# EAGLE board REM_Scan (EAGLE 9.6.2)
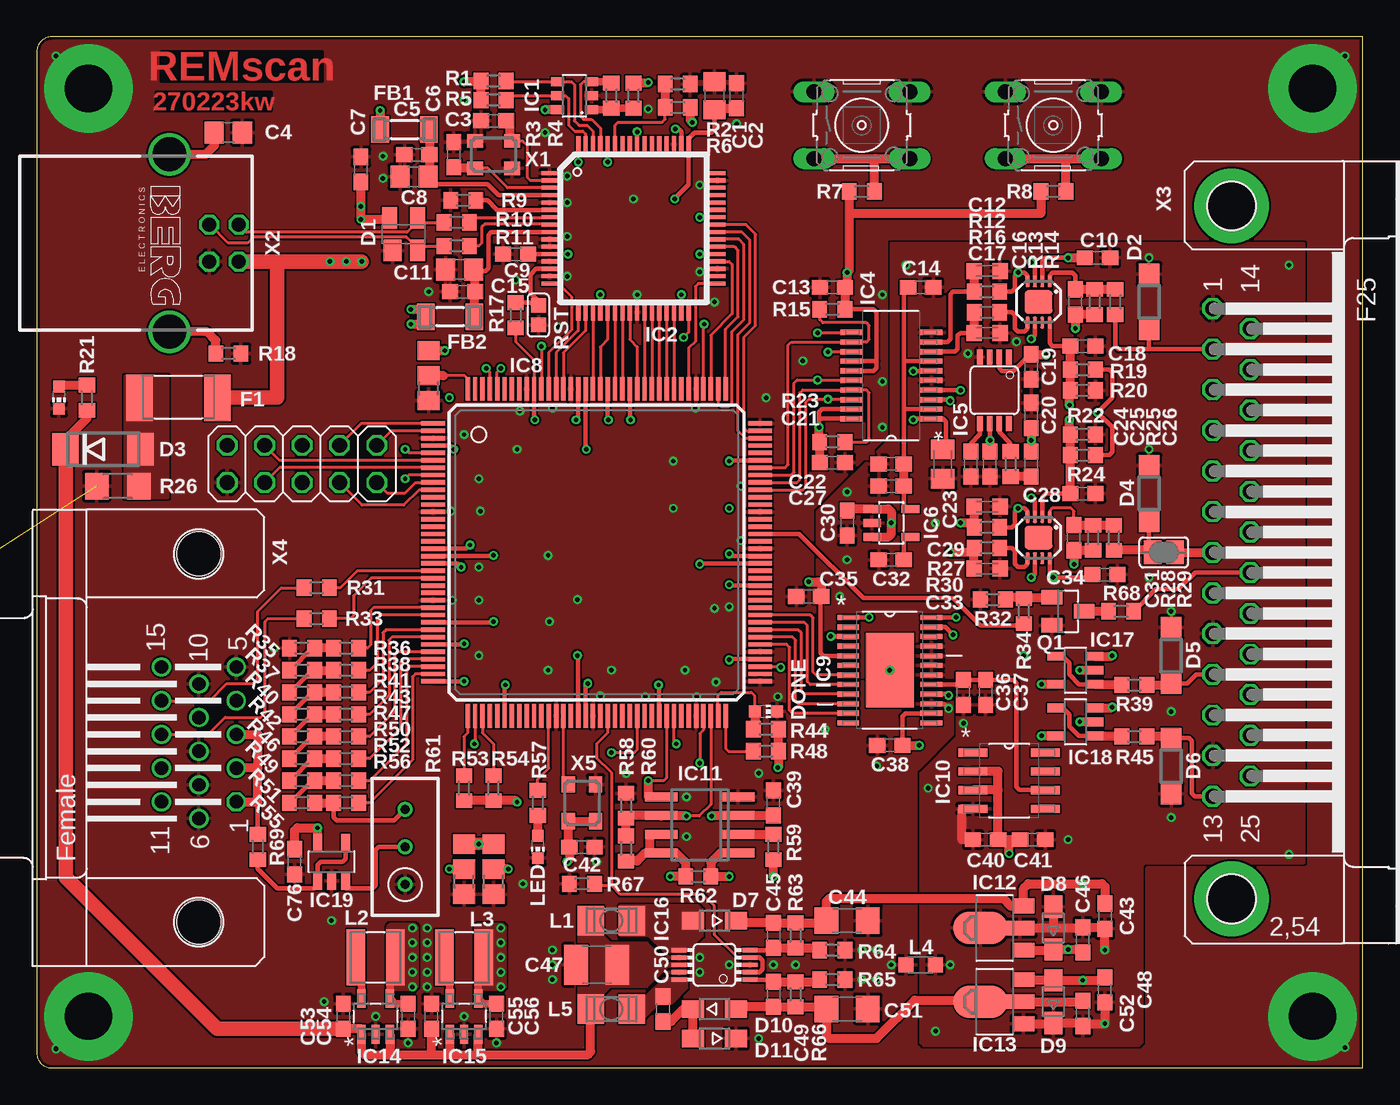
[diagram p5: board, top side]
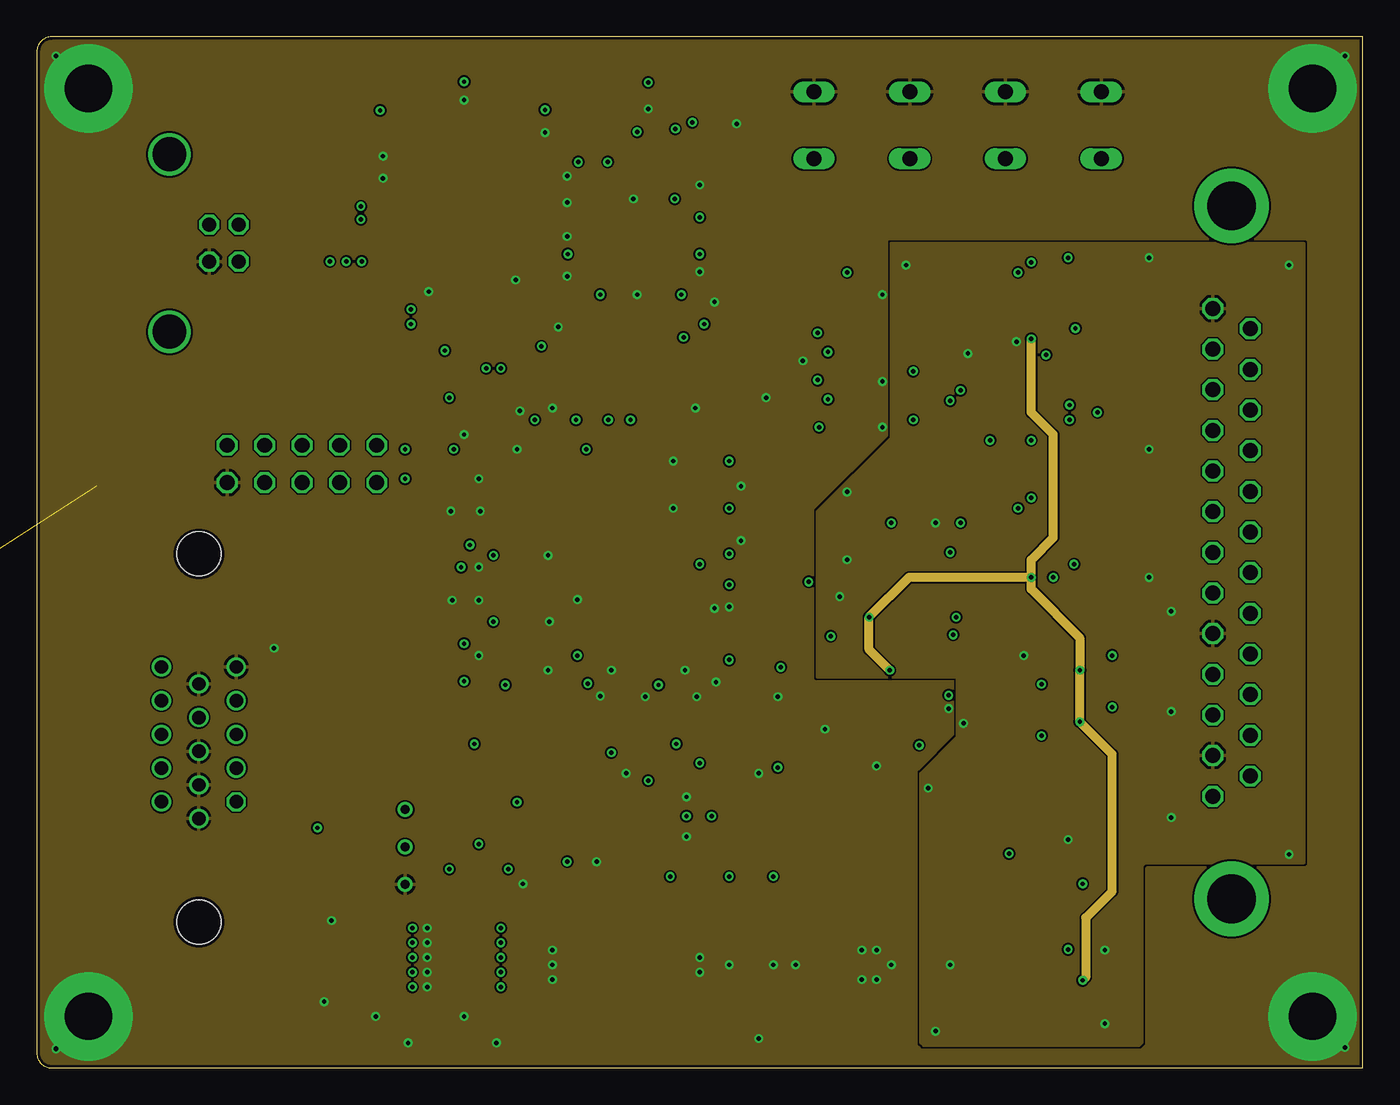
[diagram p6: board, inner layer Route2]
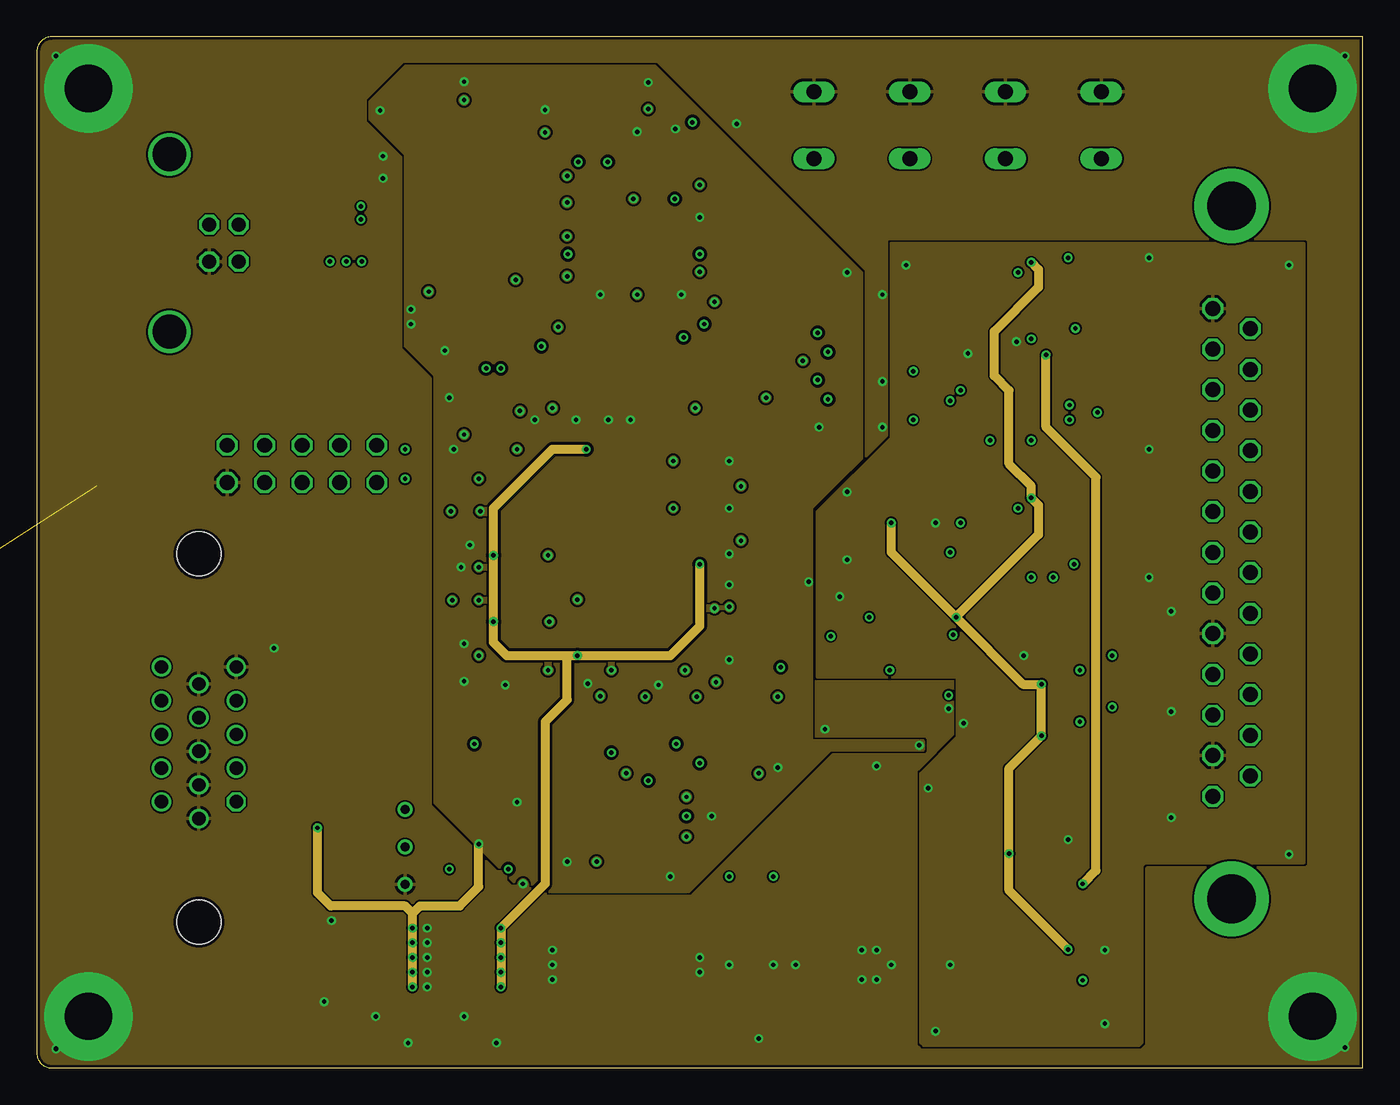
[diagram p7: board, inner layer Route15]
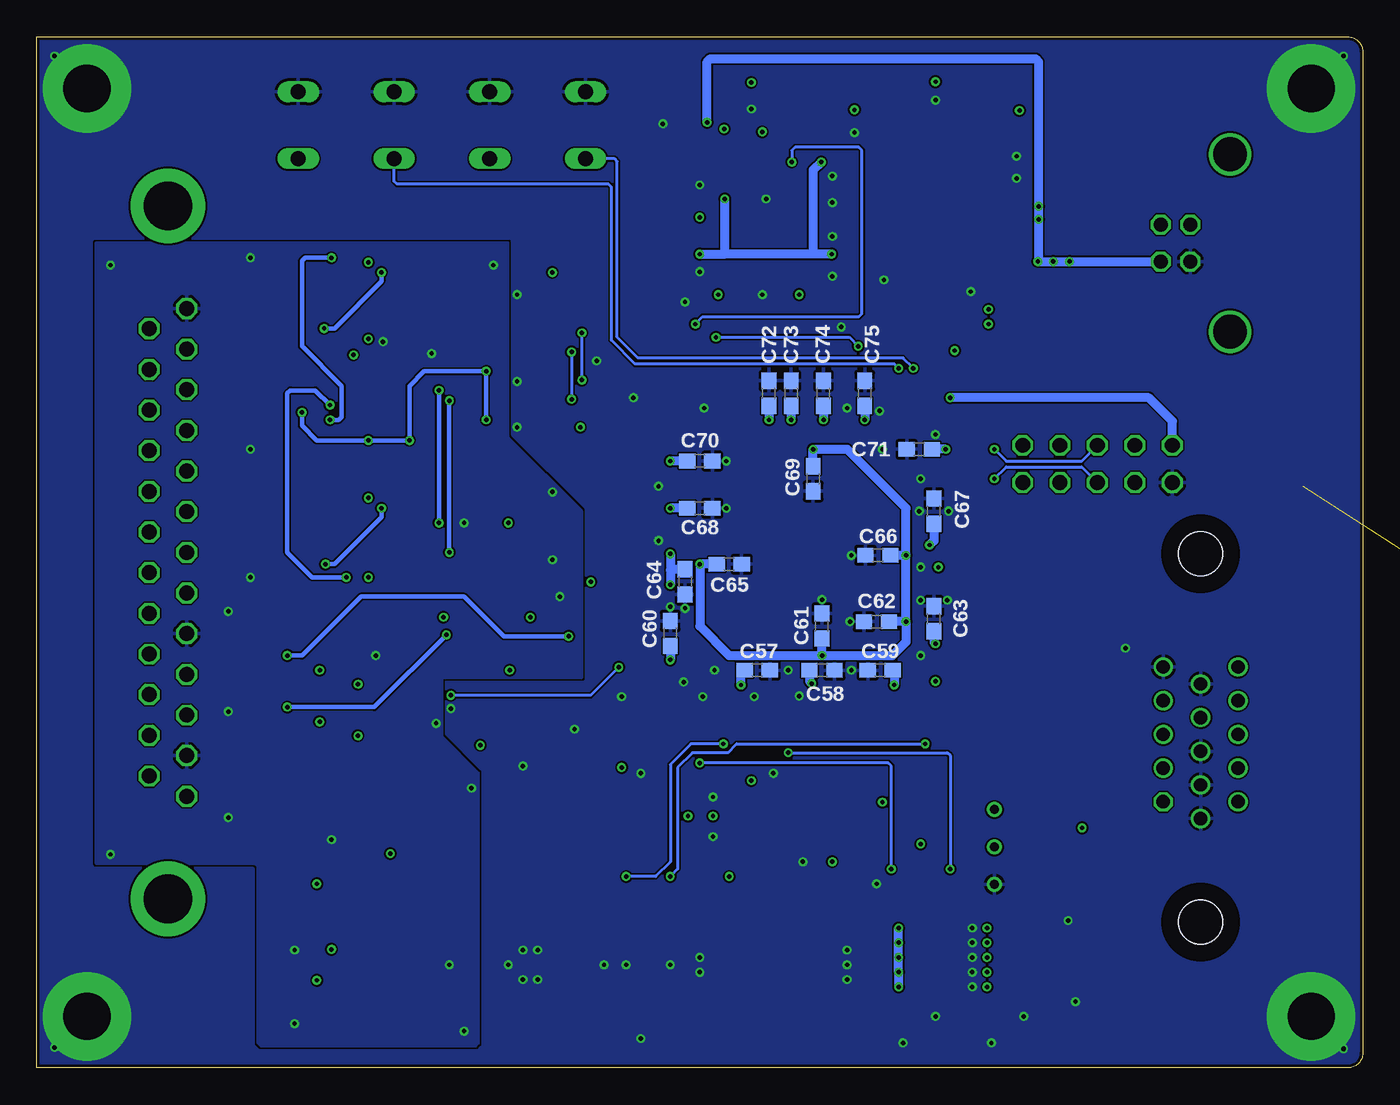
[diagram p8: board, bottom side, seen from below]

Size 90 x 70 mm. Coordinates in mm from the lower left corner, seen from the top.
Outline: 90,0 90,70 1,70 arc90 0,69 0,1 arc90 1,0 90,0
Copper layers (1+2*15+16): Top 0.035mm / dielectric 0.673mm / Route2 0.017mm / dielectric 0.15mm / Route15 0.017mm / dielectric 0.673mm / Bottom 0.035mm
Design rules "JLCPCB_4Layer_1oz": minimum track width 3.5mil, minimum drill 0.2mm, track to track 5mil, track to pad 0.2mm, pad to pad 5mil, via to via 5mil, smd to smd 0mil, copper to edge 0.2mm, drill to drill 0.5mm, minimum pad ring 0.2mm, minimum via ring 0.15mm, stop-mask expansion 0.075mm, vias tented up to drill 0.3mm, thermal gap 0.2mm

## Footprints (pad centres in the part's own frame; a part is rotated, then mirrored left to right if it is on the bottom)
BUTTON_3MM = drill 1.016 long: 1 -3.251,2.261; 2 3.251,2.261; 3 -3.251,-2.261; 4 3.251,-2.261
C0805 = smd 1.3 x 1.5: 1 -0.95,0; 2 0.95,0
C0603 = smd 1.1 x 1: 1 -0.85,0; 2 0.85,0
C0603K = smd 1.05 x 1.08: 1 -0.875,0; 2 0.875,0
C0805K = smd 1.3 x 1.6: 1 -1,0; 2 1,0
C1206 = smd 1.6 x 1.8: 1 -1.4,0; 2 1.4,0
C3225 = smd 1.6 x 2.7: 1 -1.4,0; 2 1.4,0
SOT143 = smd 1.2 x 1.44: 1 -0.75,-1.1 | smd 1 x 1.44: 2 0.95,-1.1; 3 0.95,1.1; 4 -0.95,1.1
SOD123 = smd 1.4 x 1.4: A 1.9,0; C -1.9,0
DO214AA = smd 1.8 x 2.2: A 2.55,0; C -2.55,0
SOD323-W = smd 1.5 x 1.2: A 1.45,0; C -1.45,0
1812 = smd 1.8 x 3.15: 1 -2.65,0; 2 2.65,0
SM-1206 = smd 1.2 x 1.8: 1 -1.65,0; 2 1.65,0
SOT23-6 = smd 0.6 x 0.9: 1 -0.95,-1.15; 2 0,-1.15; 3 0.95,-1.15; 4 0.95,1.15; 5 0,1.15; 6 -0.95,1.15
LQFP64 = smd 1.1 x 0.285: 1 -5.7,3.75; 2 -5.7,3.25; 3 -5.7,2.75; 4 -5.7,2.25; 5 -5.7,1.75; 6 -5.7,1.25; 7 -5.7,0.75; 8 -5.7,0.25; 9 -5.7,-0.25; 10 -5.7,-0.75; 11 -5.7,-1.25; 12 -5.7,-1.75; 13 -5.7,-2.25; 14 -5.7,-2.75; 15 -5.7,-3.25; 16 -5.7,-3.75; 33 5.7,-3.75; 34 5.7,-3.25; 35 5.7,-2.75; 36 5.7,-2.25; 37 5.7,-1.75; 38 5.7,-1.25; 39 5.7,-0.75; 40 5.7,-0.25; 41 5.7,0.25; 42 5.7,0.75; 43 5.7,1.25; 44 5.7,1.75; 45 5.7,2.25; 46 5.7,2.75; 47 5.7,3.25; 48 5.7,3.75 | smd 0.285 x 1.1: 17 -3.75,-5.7; 18 -3.25,-5.7; 19 -2.75,-5.7; 20 -2.25,-5.7; 21 -1.75,-5.7; 22 -1.25,-5.7; 23 -0.75,-5.7; 24 -0.25,-5.7; 25 0.25,-5.7; 26 0.75,-5.7; 27 1.25,-5.7; 28 1.75,-5.7; 29 2.25,-5.7; 30 2.75,-5.7; 31 3.25,-5.7; 32 3.75,-5.7; 49 3.75,5.7; 50 3.25,5.7; 51 2.75,5.7; 52 2.25,5.7; 53 1.75,5.7; 54 1.25,5.7; 55 0.75,5.7; 56 0.25,5.7; 57 -0.25,5.7; 58 -0.75,5.7; 59 -1.25,5.7; 60 -1.75,5.7; 61 -2.25,5.7; 62 -2.75,5.7; 63 -3.25,5.7; 64 -3.75,5.7
LFCSP_VD8_CP-8-2 = smd 0.3 x 0.8: 1 -0.75,-1.4; 2 -0.25,-1.4; 3 0.25,-1.4; 4 0.75,-1.4; 5 0.75,1.4; 6 0.25,1.4; 7 -0.25,1.4; 8 -0.75,1.4 | smd 1.9 x 1.6: EP 0,0
RQ-20 = smd 1.473 x 0.356: 1 -2.719,2.931; 2 -2.719,2.271; 3 -2.719,1.636; 4 -2.719,0.976; 5 -2.719,0.315; 6 -2.719,-0.32; 7 -2.719,-0.98; 8 -2.719,-1.615; 9 -2.719,-2.276; 10 -2.719,-2.936; 11 2.719,-2.936; 12 2.719,-2.276; 13 2.719,-1.615; 14 2.719,-0.98; 15 2.719,-0.32; 16 2.719,0.315; 17 2.719,0.976; 18 2.719,1.636; 19 2.719,2.271; 20 2.719,2.931
MSOP08 = smd 0.4 x 1: 1 -0.976,-2.263; 2 -0.326,-2.263; 3 0.324,-2.263; 4 0.974,-2.263; 5 0.974,2.262; 6 0.324,2.262; 7 -0.326,2.262; 8 -0.976,2.262
SOT23-DBV = smd 0.55 x 1.2: 1 -0.95,-1.3; 2 0,-1.3; 3 0.95,-1.3; 4 0.95,1.3; 5 -0.95,1.3
TQ144 = smd 1.6 x 0.3: P1 -11.1,8.75; P2 -11.1,8.25; P3 -11.1,7.75; P4 -11.1,7.25; P5 -11.1,6.75; P6 -11.1,6.25; P7 -11.1,5.75; P8 -11.1,5.25; P9 -11.1,4.75; P10 -11.1,4.25; P11 -11.1,3.75; P12 -11.1,3.25; P13 -11.1,2.75; P14 -11.1,2.25; P15 -11.1,1.75; P16 -11.1,1.25; P17 -11.1,0.75; P18 -11.1,0.25; P19 -11.1,-0.25; P20 -11.1,-0.75; P21 -11.1,-1.25; P22 -11.1,-1.75; P23 -11.1,-2.25; P24 -11.1,-2.75; P25 -11.1,-3.25; P26 -11.1,-3.75; P27 -11.1,-4.25; P28 -11.1,-4.75; P29 -11.1,-5.25; P30 -11.1,-5.75; P31 -11.1,-6.25; P32 -11.1,-6.75; P33 -11.1,-7.25; P34 -11.1,-7.75; P35 -11.1,-8.25; P36 -11.1,-8.75; P73 11.1,-8.75; P74 11.1,-8.25; P75 11.1,-7.75; P76 11.1,-7.25; P77 11.1,-6.75; P78 11.1,-6.25; P79 11.1,-5.75; P80 11.1,-5.25; P81 11.1,-4.75; P82 11.1,-4.25; P83 11.1,-3.75; P84 11.1,-3.25; P85 11.1,-2.75; P86 11.1,-2.25; P87 11.1,-1.75; P88 11.1,-1.25; P89 11.1,-0.75; P90 11.1,-0.25; P91 11.1,0.25; P92 11.1,0.75; P93 11.1,1.25; P94 11.1,1.75; P95 11.1,2.25; P96 11.1,2.75; P97 11.1,3.25; P98 11.1,3.75; P99 11.1,4.25; P100 11.1,4.75; P101 11.1,5.25; P102 11.1,5.75; P103 11.1,6.25; P104 11.1,6.75; P105 11.1,7.25; P106 11.1,7.75; P107 11.1,8.25; P108 11.1,8.75 | smd 0.3 x 1.6: P37 -8.75,-11.1; P38 -8.25,-11.1; P39 -7.75,-11.1; P40 -7.25,-11.1; P41 -6.75,-11.1; P42 -6.25,-11.1; P43 -5.75,-11.1; P44 -5.25,-11.1; P45 -4.75,-11.1; P46 -4.25,-11.1; P47 -3.75,-11.1; P48 -3.25,-11.1; P49 -2.75,-11.1; P50 -2.25,-11.1; P51 -1.75,-11.1; P52 -1.25,-11.1; P53 -0.75,-11.1; P54 -0.25,-11.1; P55 0.25,-11.1; P56 0.75,-11.1; P57 1.25,-11.1; P58 1.75,-11.1; P59 2.25,-11.1; P60 2.75,-11.1; P61 3.25,-11.1; P62 3.75,-11.1; P63 4.25,-11.1; P64 4.75,-11.1; P65 5.25,-11.1; P66 5.75,-11.1; P67 6.25,-11.1; P68 6.75,-11.1; P69 7.25,-11.1; P70 7.75,-11.1; P71 8.25,-11.1; P72 8.75,-11.1; P109 8.75,11.1; P110 8.25,11.1; P111 7.75,11.1; P112 7.25,11.1; P113 6.75,11.1; P114 6.25,11.1; P115 5.75,11.1; P116 5.25,11.1; P117 4.75,11.1; P118 4.25,11.1; P119 3.75,11.1; P120 3.25,11.1; P121 2.75,11.1; P122 2.25,11.1; P123 1.75,11.1; P124 1.25,11.1; P125 0.75,11.1; P126 0.25,11.1; P127 -0.25,11.1; P128 -0.75,11.1; P129 -1.25,11.1; P130 -1.75,11.1; P131 -2.25,11.1; P132 -2.75,11.1; P133 -3.25,11.1; P134 -3.75,11.1; P135 -4.25,11.1; P136 -4.75,11.1; P137 -5.25,11.1; P138 -5.75,11.1; P139 -6.25,11.1; P140 -6.75,11.1; P141 -7.25,11.1; P142 -7.75,11.1; P143 -8.25,11.1; P144 -8.75,11.1
SOP65P640X120-25N = smd 1.473 x 0.356: 1 -2.819,3.581; 2 -2.819,2.921; 3 -2.819,2.286; 4 -2.819,1.626; 5 -2.819,0.965; 6 -2.819,0.33; 7 -2.819,-0.33; 8 -2.819,-0.965; 9 -2.819,-1.626; 10 -2.819,-2.286; 11 -2.819,-2.921; 12 -2.819,-3.581; 13 2.819,-3.581; 14 2.819,-2.921; 15 2.819,-2.286; 16 2.819,-1.626; 17 2.819,-0.965; 18 2.819,-0.33; 19 2.819,0.33; 20 2.819,0.965; 21 2.819,1.626; 22 2.819,2.286; 23 2.819,2.921; 24 2.819,3.581 | smd 3.251 x 5.029: 25 0,0
SOIC127P600X175-8N = smd 1.981 x 0.559: 1 -2.464,1.905; 2 -2.464,0.635; 3 -2.464,-0.635; 4 -2.464,-1.905; 5 2.464,-1.905; 6 2.464,-0.635; 7 2.464,0.635; 8 2.464,1.905
SO-08 = smd 0.6 x 2.2: 1 -1.905,-2.6; 2 -0.635,-2.6; 3 0.635,-2.6; 4 1.905,-2.6; 5 1.905,2.6; 6 0.635,2.6; 7 -0.635,2.6; 8 -1.905,2.6
SOT89 = smd 1 x 1.5: 1 -1.499,-1.981; 3 1.499,-1.981 | smd 1 x 2: 2 0,-1.727 | smd 2.2 x 3.7: 2@1 0,0.94
SOT95P284X122-5N = smd 1.27 x 0.559: 1 -1.219,0.965; 2 -1.219,0; 3 -1.219,-0.965; 4 1.219,-0.965; 5 1.219,0.965
MSOP10 = smd 0.3 x 1.02: 1 -1,-2.4; 2 -0.5,-2.4; 3 0,-2.4; 4 0.5,-2.4; 5 1,-2.4; 6 1,2.4; 7 0.5,2.4; 8 0,2.4; 9 -0.5,2.4; 10 -1,2.4
SOT23-5 = smd 0.6 x 1.2: 1 -0.95,-1.306; 2 0,-1.306; 3 0.95,-1.306; 4 0.95,1.306; 5 -0.95,1.306
TSOPII-Z44 = smd 0.5 x 1.2: 1 -8.4,-5.627; 2 -7.6,-5.627; 3 -6.8,-5.627; 4 -6,-5.627; 5 -5.2,-5.627; 6 -4.4,-5.627; 7 -3.6,-5.627; 8 -2.8,-5.627; 9 -2,-5.627; 10 -1.2,-5.627; 11 -0.4,-5.627; 12 0.4,-5.627; 13 1.2,-5.627; 14 2,-5.627; 15 2.8,-5.627; 16 3.6,-5.627; 17 4.4,-5.627; 18 5.2,-5.627; 19 6,-5.627; 20 6.8,-5.627; 21 7.6,-5.627; 22 8.4,-5.627; 23 8.4,5.627; 24 7.6,5.627; 25 6.8,5.627; 26 6,5.627; 27 5.2,5.627; 28 4.4,5.627; 29 3.6,5.627; 30 2.8,5.627; 31 2,5.627; 32 1.2,5.627; 33 0.4,5.627; 34 -0.4,5.627; 35 -1.2,5.627; 36 -2,5.627; 37 -2.8,5.627; 38 -3.6,5.627; 39 -4.4,5.627; 40 -5.2,5.627; 41 -6,5.627; 42 -6.8,5.627; 43 -7.6,5.627; 44 -8.4,5.627
A0R-JMP = smd 1.5 x 1.3: 1 0,1.7; 2 0,0; 3 0,-1.7
2X05 = drill 1.016 octagon: 1 -5.08,-1.27; 2 -5.08,1.27; 3 -2.54,-1.27; 4 -2.54,1.27; 5 0,-1.27; 6 0,1.27; 7 2.54,-1.27; 8 2.54,1.27; 9 5.08,-1.27; 10 5.08,1.27
L3225P = smd 1.8 x 2: 1 -1.4,0; 2 1.4,0
SO3314 = smd 1.25 x 3.8: 1 1.35,0; 2 -1.35,0
L2012C = smd 1 x 1: 1 -1,0; 2 1,0
CHIP-LED0603 = smd 0.8 x 0.8: A 0,-0.75; C 0,0.75
SOT23 = smd 1 x 1.4: 1 -0.95,-1.1; 2 0.95,-1.1; 3 0,1.1
R0603 = smd 1 x 1.1: 1 -0.85,0; 2 0.85,0
R1206 = smd 1.6 x 1.803: 1 -1.422,0; 2 1.422,0
RTRIM3296W = drill 0.61: 1 0,-2.54; 2 0,0; 3 0,2.54
SJS = smd 1 x 1: 1 -0.662,0; 2 0.662,0
SJ = smd 1.168 x 1.6: 1 -0.762,0; 2 0.762,0
ASE = smd 1.1 x 0.9: 1 -1.25,-0.925; 2 1.25,-0.925; 3 1.25,0.925; 4 -1.25,0.925
PN61729-S = drill 0.95 octagon: 1 1.25,4.71; 2 -1.25,4.71; 3 -1.25,2.71; 4 1.25,2.71 | drill 2.3 pad 2.9: S1 -6.02,0; S2 6.02,0
F25HP = drill 1.016 octagon: 1 -16.561,-1.27; 2 -13.792,-1.27; 3 -11.049,-1.27; 4 -8.28,-1.27; 5 -5.512,-1.27; 6 -2.769,-1.27; 7 0,-1.27; 8 2.769,-1.27; 9 5.512,-1.27; 10 8.28,-1.27; 11 11.049,-1.27; 12 13.792,-1.27; 13 16.561,-1.27; 14 -15.189,1.27; 15 -12.421,1.27; 16 -9.652,1.27; 17 -6.909,1.27; 18 -4.14,1.27; 19 -1.372,1.27; 20 1.372,1.27; 21 4.14,1.27; 22 6.909,1.27; 23 9.652,1.27; 24 12.421,1.27; 25 15.189,1.27 | drill 3.302 pad 5.08: G1 -23.52,0; G2 23.52,0
HDF15H = drill 0.9 octagon: 1 4.329,2.54 | drill 0.9: 2 2.043,2.54; 3 -0.243,2.54; 4 -2.529,2.54; 5 -4.815,2.54; 6 5.472,0; 7 3.186,0; 8 0.9,0; 9 -1.386,0; 10 -3.672,0; 11 4.329,-2.54; 12 2.043,-2.54; 13 -0.243,-2.54; 14 -2.529,-2.54; 15 -4.815,-2.54 | hole 3: -12.5,0; 12.5,0

## Placement (x,y rotation side)
BTN1  BUTTON_3MM  [BUTTON_3MM]  56,64 0 top
BTN2  BUTTON_3MM  [BUTTON_3MM]  69,64 0 top
C1  4.7µF 50V  [C0805]  46,66 90 top
C2  100nF  [C0603]  47.5,66 90 top
C3  27pF  [C0603]  31,64.3 180 top
C4  10nF 500V  [C0805]  13,63.5 180 top
C5  100nF  [C0603]  25.8,62 180 top
C6  27pF  [C0603]  28.3,62 90 top
C7  10nF  [C0603]  22,61 90 top
C8  4.7µF 50V  [C0805]  25.6,60.5 180 top
C9  100nF  [C0603]  32.5,55.25 180 top
C10  100nF  [C0603]  72,55 180 top
C11  4.7µF 50V  [C0805]  28.7,54.2 180 top
C12  2.7nF  [C0603K]  64.5,54.1 0 top
C13  100nF  [C0603]  54,53 0 top
C14  100nF  [C0603]  60,53 180 top
C15  100nF  [C0603]  28.9,52.7 180 top
C16  1nF 5%  [C0603]  70.5,52 90 top
C17  2.7nF  [C0603K]  64.5,49.9 180 top
C18  100nF  [C0603]  71,49 180 top
C19  100nF  [C0603]  67.5,47.6 90 top
C20  1µF  [C0603]  67.5,44.3 270 top
C21  100nF  [C0603]  54,41.1 180 top
C22  100nF  [C0603]  58,41 0 top
C23  22µF  [C0805K]  61.5,41 270 top
C24  100nF  [C0603]  63.4,41 90 top
C25  100nF  [C0603]  64.7,41 90 top
C26  10nF  [C0603]  67.5,41 90 top
C27  10µF  [C0603]  58,39.5 180 top
C28  100nF  [C0603]  71,39 180 top
C29  2.7nF  [C0603K]  64.5,38.1 0 top
C30  100nF/50V  [C0603]  55,37 270 top
C31  1nF 5%  [C0603]  70.4,36 90 top
C32  10nF  [C0603]  58,34.5 180 top
C33  2.7nF  [C0603K]  64.5,33.9 180 top
C34  100nF  [C0603]  72.5,33.5 180 top
C35  10µF  [C0603]  52.4,32 0 top
C36  10µF  [C0603]  62.9,25.5 90 top
C37  100nF  [C0603]  64.4,25.5 90 top
C38  100nF  [C0603]  57.9,21.9 0 top
C39  100nF  [C0603]  50,18 90 top
C40  100nF  [C0603]  64.4,15.5 0 top
C41  10µF  [C0603]  67.6,15.5 180 top
C42  100nF  [C0603]  37,15 180 top
C43  100nF/50V  [C0603]  72.5,10.3 270 top
C44  1u  [C1206]  55,10 180 top
C45  4p7  [C0603]  50,9 270 top
C46  10µF  [C0603]  71,8.7 90 top
C47  4.7uF  [C3225]  38,7 180 top
C48  10µF  [C0603]  72.5,5.3 90 top
C49  100p  [C0603]  50,5 270 top
C50  100n  [C0603]  42.5,4 270 top
C51  1u  [C1206]  55,4 0 top
C52  100nF/50V  [C0603]  71,3.7 90 top
C53  4.7µF  [C0603]  20.8,3.5 90 top
C54  10µF  [C0603]  25.2,3.5 270 top
C55  4.7µF  [C0603]  26.8,3.5 90 top
C56  10µF  [C0603]  31.2,3.5 270 top
C57  100nF  [C0603]  41.1,27 0 bottom
C58  100nF  [C0603]  36.7,27 0 bottom
C59  100nF  [C0603]  32.75,27 180 bottom
C60  100nF  [C0603]  47,29.5 90 bottom
C61  100nF  [C0603]  36.7,30 90 bottom
C62  100nF  [C0603]  33,30.3 180 bottom
C63  100nF  [C0603]  29.1,30.5 90 bottom
C64  100nF  [C0603]  46,33 270 bottom
C65  100nF  [C0603]  43,34.2 0 bottom
C66  100nF  [C0603]  32.9,34.8 180 bottom
C67  100nF  [C0603]  29.1,37.8 90 bottom
C68  100nF  [C0603]  45,38 0 bottom
C69  100nF  [C0603]  37.3,40 270 bottom
C70  100nF  [C0603]  45,41.2 0 bottom
C71  100nF  [C0603]  30.1,42 180 bottom
C72  100nF  [C0603]  40.3,45.8 90 bottom
C73  100nF  [C0603]  38.8,45.8 90 bottom
C74  100nF  [C0603]  36.6,45.8 90 bottom
C75  100nF  [C0603]  33.8,45.8 90 bottom
C76  100nF  [C0603]  17.5,14 90 top
D1  PRTR5V0U2X  [SOT143]  24.9,56.6 0 top
D2  TVS  [SOD123]  75.5,52 90 top
D3  B340A-13-F  [DO214AA]  4.5,42 0 top
D4  TVS  [SOD123]  75.5,39 90 top
D5  TVS  [SOD123]  77,28 90 top
D6  TVS  [SOD123]  77,20.5 270 top
D7  [SOD323-W]  46,10 180 top
D8  BAT54  [SOD323-W]  69,9.5 90 top
D9  BAT54  [SOD323-W]  69,4.5 90 top
D10  [SOD323-W]  46,4 0 top
D11  [SOD323-W]  46,2 180 top
F1  500mA  [1812]  9.6,45.5 0 top
FB1  1k@100MHz  [SM-1206]  24.95,63.7 0 top
FB2  1k@100MHz  [SM-1206]  28.05,51 0 top
IC1  93LC46BT  [SOT23-6]  36.5,66 90 top
IC2  [LQFP64]  40.5,57 0 top
IC3  ADA4941-1YCPZ  [LFCSP_VD8_CP-8-2]  68,52 180 top
IC4  AD7903  [RQ-20]  58,47 180 top
IC5  ADR435ARMZ  [MSOP08]  65,46 180 top
IC6  TPS736XXDBVT  [SOT23-DBV]  58,37 270 top
IC7  ADA4941-1YCPZ  [LFCSP_VD8_CP-8-2]  68,36 180 top
IC8  6SLX9TQG144  [TQ144]  38,35 0 top
IC9  AD5752RBREZ  [SOP65P640X120-25N]  57.9,27 0 top
IC10  REF192GSZ  [SOIC127P600X175-8N]  66,19.5 0 top
IC11  M25P80  [SO-08]  45,16.5 90 top
IC12  78L05  [SOT89]  65,9.5 90 top
IC13  79L05  [SOT89]  65,4.5 90 top
IC14  LM3761MF-3.3  [SOT95P284X122-5N]  23,3.5 90 top
IC15  LM3761MF-1.2  [SOT95P284X122-5N]  29,3.5 90 top
IC16  LT1945  [MSOP10]  46,7 90 top
IC17  NCV2071  [SOT23-5]  70.5,27 90 top
IC18  NCV2071  [SOT23-5]  70.5,23.5 90 top
IC19  TLV3541  [SOT23-5]  20,14 0 top
IC20  CY7C1049CV33T  [TSOPII-Z44]  -23.3,25.1 90 top  (outside the outline)
JMP1  1k  [A0R-JMP]  26.6,47 180 top
JMP2  1k  [A0R-JMP]  29,13.5 180 top
JMP3  1k  [A0R-JMP]  31,13.5 180 top
JP1  [2X05]  18,41 180 top
L1  10u  [L3225P]  39,10 0 top
L2  2.2µH  [SO3314]  23,7.5 180 top
L3  2.2µH  [SO3314]  29,7.5 180 top
L4  1000R BLM18AG102SN1  [L2012C]  60,7 180 top
L5  10u  [L3225P]  39,4 0 top
LED  RED  [CHIP-LED0603]  34,15 180 top
LED1  RED  [CHIP-LED0603]  1.5,45.5 180 top
LED2  GREEN  [CHIP-LED0603]  49.5,24.2 270 top
Q1  AO3404A  [SOT23]  70,31 270 top
R1  10k  [R0603]  31,67 180 top
R2  10k  [R0603]  43.5,66.8 180 top
R3  2k2  [R0603]  39,66 270 top
R4  10k  [R0603]  40.5,66 90 top
R5  10k  [R0603]  31,65.7 180 top
R6  4k7  [R0603]  43.5,65.2 180 top
R7  4k7  [R0603]  56,59.5 0 top
R8  4k7  [R0603]  69,59.5 0 top
R9  12k  [R0603]  28.95,58.9 180 top
R10  33R  [R0603]  28.5,57.4 0 top
R11  33R  [R0603]  28.5,55.8 0 top
R12  20R  [R0603]  64.5,52.7 180 top
R13  10k 0.05%  [R0603]  71.8,52 90 top
R14  20k 0.1%  [R0603]  73.2,52 270 top
R15  47k  [R0603]  54,51.5 0 top
R16  20R  [R0603]  64.5,51.3 180 top
R17  10k  [R0603]  32.5,51.1 270 top
R18  1M  [R0603]  13,48.5 180 top
R19  20k 0.1%  [R0603]  71,47.4 0 top
R20  10k 0.05%  [R0603]  71,46 180 top
R21  330R  [R0603]  3.4,45.5 270 top
R22  10k 0.05%  [R0603]  71,43 180 top
R23  47k  [R0603]  54,42.5 180 top
R24  10k 0.05%  [R0603]  71,41.6 0 top
R25  82k  [R0603]  66.1,41 90 top
R26  35V  [R1206]  5.5,39.5 0 top
R27  20R  [R0603]  64.5,36.7 180 top
R28  10k 0.05%  [R0603]  71.7,36 90 top
R29  20k 0.1%  [R0603]  73.1,36 270 top
R30  20R  [R0603]  64.5,35.3 180 top
R31  82R5  [R0603]  19,32.6 180 top
R32  4k7  [R0603]  64.9,31.8 180 top
R33  82R5  [R0603]  19,30.5 180 top
R34  100R  [R0603]  67,31 270 top
R35  20k 0.1%  [R0603]  18,28.5 0 top
R36  20k 0.1%  [R0603]  21,28.5 180 top
R37  10k 0.05%  [R0603]  18,27 180 top
R38  20k 0.1%  [R0603]  21,27 180 top
R39  20R  [R0603]  74.5,26 180 top
R40  10k 0.05%  [R0603]  18,25.5 180 top
R41  20k 0.1%  [R0603]  21,25.5 180 top
R42  10k 0.05%  [R0603]  18,24 180 top
R43  20k 0.1%  [R0603]  21,24 180 top
R44  330R  [R0603]  49.5,23 180 top
R45  20R  [R0603]  74.5,22.5 180 top
R46  10k 0.05%  [R0603]  18,22.5 180 top
R47  20k 0.1%  [R0603]  21,22.5 180 top
R48  1k  [R0603]  49.5,21.5 180 top
R49  10k 0.05%  [R0603]  18,21 180 top
R50  20k 0.1%  [R0603]  21,21 180 top
R51  10k 0.05%  [R0603]  18,19.5 180 top
R52  20k 0.1%  [R0603]  21,19.5 180 top
R53  4k7  [R0603]  29,19 90 top
R54  4k7  [R0603]  31,19 90 top
R55  10k 0.05%  [R0603]  18,18 180 top
R56  20k 0.1%  [R0603]  21,18 180 top
R57  330R  [R0603]  34,18 90 top
R58  100R  [R0603]  40,17.8 270 top
R59  100R  [R0603]  50,15 270 top
R60  100R  [R0603]  40,14.9 270 top
R61  [RTRIM3296W]  25,15 0 top
R62  2k4  [R0603]  44.9,13 180 top
R63  443k  [R0603]  51.5,9 270 top
R64  80k6  [R0603]  54,8 0 top
R65  24k9  [R0603]  54,6 180 top
R66  137k  [R0603]  51.5,5 270 top
R67  4k7  [R0603]  37,12.5 180 top
R68  20R  [R0603]  73.6,31 180 top
R69  75R  [R0603]  15,15 270 top
RST  [SJS]  34.05,51.1 90 top
SJ1  [SJ]  76.5,35 0 top
X1  ABM  [ASE]  31,62 0 top
X2  PN61729-S  [PN61729-S]  9,56 270 top
X3  [F25HP]  81.1,35 270 top
X4  [HDF15H]  11,22.4 270 top
X5  50MHz ASE  [ASE]  37,18 90 top

## Tracks (layer width: path | path; a pad name or v marks a point on that pad's centre or on a via)
1V2  (via drill 0.3)
  Top 0.3: IC8.P128 37.25,42.05 v37.3,42 | v31,34.8 30.95,34.75 IC8.P19 | IC8.P28 30.95,30.25 v31,30.3 | IC8.P52 36.75,27.95 v36.7,28 | IC8.P89 45.05,34.25 v45,34.2
  Top 0.5: C56.1 30.33,4.35 IC15.4 29.96,7.12 L3.2
  Route15 0.6: v37.3,42 35,42 31,38 v31,34.8 v31,30.3 31,28.9 31.9,28 36,28 | 36,28 v36.7,28 43,28 45,30 v45,34.2 | v31.5,5.5 v31.5,6.5 v31.5,7.5 v31.5,8.5 v31.5,9.5 34.5,12.5 34.5,23.5 36,25 36,28
  Bottom 0.6: v36.7,28 43,28 45,30 v45,34.2 C65.1 | v31,30.3 v31,34.8 | v31,34.8 31,38 35,42 v37.3,42 C69.1 | v31,34.8 C66.1 | v31,30.3 C62.1 | v36.7,28 C61.1 | v36.7,28 31.93,28 31,28.93 v31,30.3 | v31.5,5.5 v31.5,6.5 v31.5,7.5 v31.5,8.5 v31.5,9.5
  pour Top (no thermals): 29.8,5.5 29.8,9.6 30,9.8 31.6,9.8 31.8,9.6 31.8,5.5 31.6,5.3 30,5.3
2.5V_A
  Top 0.3: C22.2 58.85,44.73 | 58.85,44.73 IC4.2 | 58.85,44.73 58.85,47.98 | 58.85,47.98 IC4.7 | 58.85,47.98 58.85,53 C14.2 | IC6.5 58.85,37.95 C27.1
  Top 0.6: C27.1 C22.2
3V3  (via drill 0.3)
  Top 0.2: R17.2 32.5,49.3 33.75,48.05 IC8.P135
  Top 0.3: IC8.P122 40.25,44.05 v40.3,44 | IC8.P125 38.75,44.05 v38.8,44 | IC8.P129 36.75,44.15 v36.6,44 | IC8.P4 28.05,42.25 v28.3,42 | IC8.P36 v29,26.25 | IC8.P31 28.95,28.75 v29,28.8 | IC8.P18 29.15,35.25 v29.4,35.5 | IC8.P20 28.55,34.25 v28.8,34 | v31.8,26 31.75,25.95 IC8.P42 | IC8.P53 37.25,25.95 v37.4,26.1 | IC8.P63 42.25,25.95 v42.2,26 | IC8.P76 47.05,27.75 v47,27.7 | IC8.P86 47.05,32.75 v47,32.8 | IC8.P90 47.15,34.75 v47,34.9 | IC8.P103 47.05,41.25 v47,41.2 | v33.8,44 33.75,44.05 IC8.P135 | IC2.20 v38.25,52.5 | IC2.31 v43.75,52.5 | IC2.42 v45,57.75 | IC2.50 43.75,63.55 43.55,63.75 v43.35,63.75 | IC2.56 v40.75,63.55 | IC4.19 53.3,44.73 53.1,44.53 53.1,44.07 | 53.1,44.07 v53.1,43.5 | IC4.20 53.1,44.07 | IC4.15 56.8,47.32 57,47.52 57,48 | 57,48 57,51.3 56.8,51.5 R15.2 | IC4.14 55.28,48 57,48 | IC9.14 58.95,24.08 58.75,23.88 C38.2 | IC9.5 53.4,27.96 53.2,28.16 53.2,32 C35.2
  Top 0.5: 23.96,7.12 L2.2 23.96,7.12 | C54.1 24.33,4.35 IC14.4 23.96,7.12
  Top 0.6: R44.1 R48.1 50.35,20.45 v50.3,20.4 | C39.1 49.98,17.14 IC11.3 45.84,17.14 v45.8,17.1 | X5.1 X5.4 36.08,15.07 C42.2 36.15,14.15 v36,14 | 41.6,14.6 IC11.8 43.41,14.6 44.05,13.95 R62.2 v43,13 | 41.6,14.6 41.3,14.6 40.75,14.05 R60.2 | IC11.7 41.6,15.87 41.6,14.6 | JMP1.3 v27.7,48.7 | IC1.6 v34.5,65.05 | R4.2 40.5,66.9 v41.5,66.9 | v29,66.95 30.15,66.95 R1.2 R5.2 | v25.4,51.5 25.9,51.5 FB2.1 25.9,50.5 v25.4,50.5 | v23.3,65 FB1.1 | C21.2 R23.2 53.1,42.5 v53.1,43.5 | R15.2 C13.2 55,53.15 v55,54 55.15,54.15 55.15,58 | C38.2 v59.9,21.9 | v52.4,33 53.05,33 53.25,32.8 C35.2 | R8.1 68.15,58 55.15,58 | 55.15,58 R7.1 | v32.6,18.05 32.5,18.15 R54.1 R53.1 | IC19.5 v19.05,16.3 17.7,16.3 17.5,16.1 C76.2
  Top 0.8: JMP3.3 v30,15.2 JMP2.3
  Route15 0.6: v25.5,5.5 v25.5,6.5 v25.5,7.5 v25.5,8.5 v25.5,9.5 25.5,10.5 | 25.5,10.5 26,11 28.7,11 30,12.3 v30,15.2 | 25.5,10.5 25,11 19.95,11 19.05,11.9 v19.05,16.3
  Bottom 0.6: v47,34.9 47,33.8 | 47,33.8 v47,32.8 | C70.1 v47,41.2 | C68.1 v47,38 | C64.1 46.95,33.85 47,33.8 | C57.1 42.1,27 42.2,26.9 v42.2,26 | C59.1 31.8,26.9 v31.8,26 | C58.1 37.55,26.25 v37.4,26.1 | C60.1 v47,27.7 | C72.1 v40.3,44 | C74.1 v36.6,44 | C75.1 v33.8,44 | v28.3,42 C71.1 | C67.1 29.1,35.8 v29.4,35.5 | C63.1 29.1,28.9 v29,28.8 | C73.1 v38.8,44 | JP1.9 12.92,43.9 14.52,45.5 v28,45.5
  pour Route15 (isolate 0.2, rank 2): 52.6,37.9 56,41.3 56,54 42,68 25,68 22.6,65.6 22.6,64.4 25,62 25,49 27,47 27,18 33,12 44.3,12 53.9,21.6 60.2,21.6 60.2,22.2 52.6,22.2
  pour Top (no thermals): 23.8,5.5 23.8,9.52 23.86,9.66 24,9.8 25.6,9.8 25.8,9.6 25.8,5.5 25.6,5.3 24,5.3
5V
  Top 0.6: 23.95,0.9 22.23,0.9 22.04,1.1 IC14.1 22.04,2.65 C53.1 | 23.95,0.9 26.8,0.9 | 26.8,0.9 C55.1 | 26.8,0.9 28.05,0.9 | 28.05,0.9 29.77,0.9 29.97,1.1 | IC14.3 23.96,0.92 23.95,0.9 | 29.97,1.1 29.96,1.1 IC15.3 | IC15.1 28.04,0.92 28.05,0.9 | 29.97,1.1 30.17,0.9 37.4,0.9 37.6,1.1 L5.1 | D3.C 1.95,42.65 3.4,44.1 R21.2
  Top 1: D3.C 1.95,12.95 12.25,2.65 C53.1
  pour Top (no thermals): 44.1,6.9 42.8,6.9 41.4,5.5 38.9,5.5 38.4,5 38.4,3.1 36.8,3.1 36.8,10.9 38.4,10.9 38.4,9 38.9,8.5 41.4,8.5 42.8,7.1 44.1,7.1
!CONTROL
  Top 0.3: 71.2,31 Q1.3
  Top 0.6: R68.2 71.2,31
!PWREN  (via drill 0.3)
  Top 0.2: IC8.P112 45.25,50.45 v45.3,50.5 | v38.75,61.5 IC2.60
  Bottom 0.2: v45.3,50.5 44.8,51 34.2,51 34,51.2 34,62.3 34.2,62.5 38.55,62.5 38.75,62.3 v38.75,61.5
!PWRSAV
  Top 0.2: IC2.59 39.25,64 39.45,64.2 42.45,64.2 42.65,64.4 R6.2
  Top 0.6: R2.2 R6.2
!SHDN
  Top 0.2: IC8.P56 38.75,22.75 38,22 38,21.05 39,20.05 39,12.4 | IC16.4 47.55,7.5 46,9.05 46,11 45.2,11.8 39.6,11.8 39,12.4 | R67.1 37.95,12.4 39,12.4
  Top 0.3: IC16.2 49.05,6.5 49.26,6.71 49.26,7.29 49.05,7.5 IC16.4
!SUSPEND
  Top 0.2: IC2.36 47,54.75 47.2,54.55 47.2,51.2 45.75,49.75 IC8.P111
+3V  (1 unrouted)
+8V  (via drill 0.3)
  Top 0.3: IC5.2 65.33,47.5 65.53,47.3 66.3,47.3 67.45,48.45 C19.2
  Top 0.6: C43.1 72.5,12.3 72.3,12.5 v71,12.5 67.3,12.5 66.98,12.18 IC12.3 66.1,11 65.6,11.5 53.8,11.5 53.6,11.3 C44.2 53.45,9.85 R63.1 C45.1 47.6,9.85 D7.C | v68.5,48.4 67.55,48.4 C19.2
  Route15 0.6: v71,12.5 71.9,13.4 71.9,40.1 68.5,43.5 v68.5,48.4
-8V
  Top 0.6: D10.A 47.6,4.15 C49.2 R66.2 53.45,4.15 C51.1 53.6,2.2 53.8,2 57,2 59.6,4.6 64,4.6 | IC13.2@1 65.4,4.5 IC13.2 70.95,4.5 C52.2
  Top 1: 64,4.6 65.3,4.6 65.4,4.5
ADC1_SDO
  Top 0.2: IC8.P100 51.6,39.75 51.8,39.95 51.8,45.82 52,46.02 IC4.17 56.3,46.02 56.5,45.82 56.5,42.7 56.3,42.5 R23.1
ADC2_SDO
  Top 0.2: IC8.P102 50.8,40.75 51,40.95 51,49.08 51.2,49.28 IC4.12 56.3,49.28 56.5,49.48 56.5,50.39 56.3,50.59 53.35,50.59 53.15,50.79 R15.1
ADC_CNV  (via drill 0.3)
  Top 0.2: IC8.P101 51.2,40.25 51.4,40.45 51.4,46.5 51.6,46.7 v53,46.7 55.28,46.7 IC4.16 | IC4.11 55.28,49.9 v53,49.9
  Bottom 0.2: v53,46.7 v53,49.9
ADC_OFFSET_1  (via drill 0.3)
  Top 0.3: C28.2 68.5,39 68.25,38.75 IC7.2 | R22.2 70.1,43 | IC3.2 68.25,54.8 68.45,55 v70,55
  Top 0.6: R22.2 R24.1 C28.2 | 70.1,43 v70.1,44 | v70,55 C10.2
  Bottom 0.3: v70.1,44 69.5,44 69.3,44.2 69.3,46.3 72,49 72,54.8 71.8,55 v70,55
ADC_OFFSET_2  (via drill 0.3)
  Top 0.3: C18.2 68.95,49 68.75,49.2 IC3.8 | 70.1,46 R20.2 | IC7.8 68.75,33.55 v69,33.3 71.45,33.3 C34.2
  Top 0.6: R20.2 R19.1 C18.2 | v70.1,45 70.1,46
  Bottom 0.3: v69,33.3 71.3,33.3 73,35 73,45.8 72.8,46 71.1,46 v70.1,45
ADC_REF  (via drill 0.3)
  Top 0.3: C23.1 61.7,42 61.7,43.87 61.5,44.07 IC4.1 59.5,44.07 v59.5,44 | IC4.6 60.72,47.3 v59.5,47.3 | IC5.6 64.7,43.71 v64.7,42.6 | R24.2 72.8,41.6 73,41.8 73,43.5 v72,44.5 73,45.5 73,47.2 72.8,47.4 R19.2
  Top 0.6: C20.2 v67.5,42.6 C26.2 | v64.7,42.6 C25.2
  Bottom 0.3: v59.5,44 v59.5,47.3 63.7,47.3 64.7,46.3 v64.7,42.6 v67.5,42.6 71,42.6 72,43.6 v72,44.5
ADC_SCK  (via drill 0.3)
  Top 0.2: IC8.P99 52,39.25 52.2,39.45 52.2,45.2 52.4,45.4 v53.7,45.4 55.28,45.4 IC4.18 | IC4.13 55.28,48.6 v53.7,48.6
  Bottom 0.2: v53.7,48.6 v53.7,45.4
AGND  (via drill 0.3)
  Top 0.6: IC12.2@1 IC12.2 69,9.5 | IC13.1 68.95,3 D9.C 70.8,3.05 C52.1 71,3 v72.5,3 C48.1 | 69,9.5 70.95,9.5 C46.2 72.4,9.55 C43.2 v72.5,8 | D8.A 69,9.5 | C40.1 62.8,15.5 62.8,17.59 IC10.4
  other vias: 70,15.5 62,7 62.9,23.4 55,34.5 55,39.1 63.2,48.5 66.5,49.3 59,54.5 85,54.5 85,14.5 61,2.5 60.5,19 77,31 77,17 75.5,42 75.5,55 77,24.2 75.5,33.3 67,28 61,37 54.5,32
  pour Bottom: 86,56 86,13.9 75.2,13.9 75,13.7 75,1.7 74.8,1.5 60.2,1.5 60,1.7 60,20 62.5,22.5 62.5,26.5 53,26.5 53,37.8 58,42.8 58,56
  pour Route15: 86,56 86,13.9 75.2,13.9 75,13.7 75,1.7 74.8,1.5 60.2,1.5 60,1.7 60,20 62.5,22.5 62.5,26.5 53,26.5 53,37.8 58,42.8 58,56
  pour Top: 86,56 86,13.9 75.2,13.9 75,13.7 75,1.7 74.8,1.5 60.2,1.5 60,1.7 60,20 62.5,22.5 62.5,26.5 53,26.5 53,37.8 58,42.8 58,56
  pour Route2: 86,56 86,13.9 75.2,13.9 75,13.7 75,1.7 74.8,1.5 60.2,1.5 60,1.7 60,20 62.5,22.5 62.5,26.5 53,26.5 53,37.8 58,42.8 58,56
AVDD  (via drill 0.3)
  Top 0.3: IC3.3 67.75,54.45 v67.5,54.7 | IC7.3 67.75,38.45 v67.5,38.7 | IC9.24 62.38,30.58 v62.4,30.6
  Top 0.6: IC12.1 68.95,8 D8.C v70,8.05 70.8,8.05 C46.1 | C41.2 66.1,15.5 | 66.1,15.5 C40.2 65.25,18.86 | 65.25,18.86 IC10.3 | 65.25,18.86 65.25,20.14 IC10.2 | C30.1 55,37.95 IC6.1 57.8,37.95 58,37.75 v58,37 58,36.25 57.8,36.05 IC6.3 | v66,14.55 66,15.4 66.1,15.5 | IC17.5 v68.2,26.05 | IC18.5 v68.2,22.55
  Route15 0.6: v70,8.05 66,12.05 v66,14.55 66,20.35 v68.2,22.55 v68.2,26.05 66.95,26.05 v62.4,30.6 | v62.4,30.6 58,35 v58,37 | v62.4,30.6 68,36.2 68,38.2 v67.5,38.7 67.5,39.5 66,41 66,46 65,47 65,50 68,53 68,54.2 v67.5,54.7
AVSS  (via drill 0.3)
  Top 0.3: IC3.6 67.75,49.75 v67.5,49.5 | IC7.6 67.75,33.55 v67.5,33.3 | IC9.1 56.48,30.58 v56.5,30.6
  Top 0.6: IC13.3 68.95,6 D9.A v71,5.95 72.3,5.95 C48.2 | IC17.2 v70.8,27 | IC18.2 v70.8,23.5
  Route2 0.6: v71,5.95 71.2,6.15 71.2,10.2 73,12 73,21.3 v70.8,23.5 v70.8,27 70.8,29.2 67.5,32.5 v67.5,33.3 | v67.5,33.3 67.5,34.5 69,36 69,43 67.5,44.5 v67.5,49.5 | IC9.25 56.5,28.4 v56.5,30.6 59.2,33.3 v67.5,33.3
  other vias: 57.9,27
BTN1  (via drill 0.3)
  Top 0.2: IC8.P141 30.75,47.25 v30.5,47.5
  Top 0.6: BTN1.3 56.9,61.74 | 56.9,61.74 BTN1.4 | R7.2 56.85,61.69 56.9,61.74
  Bottom 0.2: v30.5,47.5 31.2,48.2 49.2,48.2 50.6,49.6 50.6,61.54 50.8,61.74 BTN1.3
BTN2  (via drill 0.3)
  Top 0.2: IC8.P140 31.25,47.25 v31.5,47.5
  Top 0.6: BTN2.3 69.9,61.74 | 69.9,61.74 BTN2.4 | R8.2 69.85,61.69 69.9,61.74
  Bottom 0.2: v31.5,47.5 31.8,47.8 49.4,47.8 51,49.4 51,59.8 51.2,60 65.55,60 65.75,60.2 BTN2.3
DAC_!CLEAR
  Top 0.2: IC9.11 51.3,24.08 51.1,24.28 51.1,28.55 50.9,28.75 IC8.P78
DAC_!LDAC
  Top 0.2: IC9.10 51.7,24.71 51.5,24.91 51.5,29.05 51.3,29.25 IC8.P79
DAC_!SYNC
  Top 0.2: IC9.7 52.9,26.67 52.7,26.87 52.7,30.55 52.5,30.75 IC8.P82
DAC_REF
  Top 0.3: IC9.17 62.59,26.04 C36.2 C37.2 66.3,26.35 66.5,26.15 66.5,19.07 66.7,18.86 IC10.6
DAC_SCK
  Top 0.2: IC9.8 52.5,26.04 52.3,26.23 52.3,30.05 52.1,30.25 IC8.P81
DAC_SDI
  Top 0.2: IC9.9 52.1,25.37 51.9,25.57 51.9,29.55 51.7,29.75 IC8.P80
DAC_SDO  (via drill 0.3)
  Top 0.2: IC8.P75 50.5,27.25 v50.5,27.2
  Top 0.3: IC9.16 61.83,25.37 v61.9,25.3
  Bottom 0.2: v50.5,27.2 52.4,25.3 v61.9,25.3
DONE
  Top 0.2: IC8.P71 46.25,25.3 46.45,25.5 48.5,25.5 48.7,25.3 48.7,24.25 LED2.A
  Top 0.6: LED2.A 48.75,23.1 R44.2
FIFO_!OE
  Top 0.2: IC2.33 44.9,53.25 44.7,53.05 44.7,49.32 44.25,48.87 IC8.P114
FIFO_!RD
  Top 0.2: IC2.28 IC8.P118
FIFO_!RXF
  Top 0.2: IC2.26 IC8.P120
FIFO_!TXE
  Top 0.2: IC2.27 IC8.P119
FIFO_!WR
  Top 0.2: IC2.29 IC8.P117
FIFO_CLKOUT  (via drill 0.3)
  Top 0.2: IC2.32 44.25,49.95 v43.9,49.6 | v34.25,49 IC8.P134
  Bottom 0.2: v43.9,49.6 34.85,49.6 v34.25,49
FIFO_D0
  Top 0.2: IC2.16 35.4,53.25 36.3,52.35 36.3,50.1 34.75,48.55 IC8.P133
FIFO_D1
  Top 0.2: IC2.17 36.75,50.05 35.25,48.55 IC8.P132
FIFO_D2
  Top 0.2: IC2.18 37.25,50.05 35.75,48.55 IC8.P131
FIFO_D3
  Top 0.2: IC2.19 IC8.P127
FIFO_D4
  Top 0.2: IC2.21 38.75,49.45 38.25,48.95 IC8.P126
FIFO_D5
  Top 0.2: IC2.22 IC8.P124
FIFO_D6
  Top 0.2: IC2.23 IC8.P123
FIFO_D7
  Top 0.2: IC2.24 40.25,49.45 40.75,48.95 IC8.P121
FIFO_SIWUB
  Top 0.2: IC2.30 IC8.P116
FLASH_!CS  (via drill 0.3)
  Top 0.2: IC8.P38 29.75,22.05 v29.7,22
  Top 0.6: IC11.1 46.4,14.6 45.75,13.95 R62.1 v47,13
  Bottom 0.2: v47,13 46.5,13.5 46.5,20.4 45.5,21.4 43.1,21.4 42.5,22 v29.7,22
FLASH_DQ0/MOSI  (via drill 0.3)
  Top 0.2: 41.5,18.41 IC11.5 | IC8.P64 42.75,19.7 42.55,19.5 v41.5,19.5
  Top 0.6: v41.5,19.5 41.5,18.41
FLASH_DQ1/MISO  (via drill 0.3)
  Top 0.2: IC8.P65 43.25,22.15 v43.4,22
  Top 0.6: v50,13 R59.2
  Bottom 0.2: v43.4,22 45.6,22 47,20.6 47,14 48,13 v50,13
FLASH_SCK  (via drill 0.3)
  Top 0.2: 42.4,17.1 IC11.6 | IC8.P70 45.75,17.9 44.95,17.1 v44.1,17.1
  Top 0.6: R60.1 R58.2 40.19,17.14 IC11.6 | v44.1,17.1 42.4,17.1
FT_1V8  (via drill 0.3)
  Top 0.254: IC2.64 v36.75,61.5
  Top 0.3: v36.05,55.25 IC2.12 C9.1 | IC2.37 v45,55.25 | v43.3,59 44.25,59.95 IC2.49 44.25,63.1 44.65,63.5 45.8,63.5 46,63.7 C1.1
  Top 0.6: C1.1 46,65.15 C2.1
  Bottom 0.6: v36.05,55.25 37.3,55.25 | 37.3,55.25 43.3,55.25 | v45,55.25 43.3,55.25 | v36.75,61.5 37.3,60.95 37.3,55.25 | 43.3,55.25 v43.3,59
GND  (via drill 0.3, 0.31, 3.2 pad 6)  (2 unrouted)
  Top 0.3: IC9.15 61.59,24.71 v61.9,24.4
  other vias: 88.8,1.4 1.3,1.3 30,40 30.1,37.8 30,34 32.6,42 32.8,44.6 43.2,41.2 30,31.75 30,28 39,27 44,27 47,31.3 44.8,25.2 34.7,27 38.25,25.25 41.3,25.2 28.2,31.75 28.1,37.8 29,43 44.7,44.8 35,44.8 47.8,39.5 47.8,35.8 46.1,26.2 3.5,3.5 86.6,3.5 86.6,66.5 88.8,68.7 1.3,68.7 3.5,66.5 49,20 40,20 38,14 50.3,25.2 46,31.2 36,56.45 36,58.75 36,53.75 40.75,52.5 45,54.05 45,59.95 36,60.55 19.5,4.5 34.8,30.3 34.7,34.8 26.6,52.7 23.5,60.4 23.5,61.9 29,65.7 41.5,65.1 47.5,64.1 46,52 44.1,18.4 44.1,15.7 43.2,38 36.7,31.8 35.4,50.3 58,7 57,20.5 45,6.5 45,7.5 50,7 51.5,7 49,2 56,6 56,8 57,6 57,8 47,7 25.2,1.7 31.2,1.7 26.5,5.5 26.5,6.5 26.5,7.5 26.5,8.5 26.5,9.5 53.5,23 57.4,43.5 57.4,46.6 57.4,52.5 49.5,45.5 32.5,53.5 34.5,63.5 40.5,59 16.1,28.5 33,12.5 35,8 35,7 35,6 29,3.5 23,3.5 52,48 20,10
  pour Bottom (rank 2): 0,0 90,0 90,70 0,70
  pour Route15 (rank 3): 0,0 90,0 90,70 0,70
  pour Top (rank 2): 0,0 90,0 90,70 0,70
  pour Route2 (rank 3): 0,0 90,0 90,70 0,70
IO_P39
  Top 0.2: IC8.P39 30.25,22.75 31,22 R54.2
IO_P60  (via drill 0.3)
  Top 0.2: IC8.P60 40.75,21.6 40.55,21.4 v39,21.4
  Top 0.6: v28,13.5 JMP2.2
  Bottom 0.2: v39,21.4 28.2,21.4 28,21.2 v28,13.5
IO_P69  (via drill 0.3)
  Top 0.2: IC8.P69 45.25,22.95 45,22.7 v45,20.7
  Top 0.6: v32,13.5 JMP3.2
  Bottom 0.2: v32,13.5 32,20.5 32.2,20.7 v45,20.7
IO_P144
  Top 0.2: IC8.P144 29.25,46.8 29.05,47 27.6,47
  Top 0.6: 27.6,47 JMP1.2
N$1
  Top 0.6: IC11.2 49.98,15.87 R59.1
N$00002
  Top 0.3: IC4.9 61.8,49.28 62,49.48 62,52.5 62.2,52.7 63.62,52.7
  Top 0.6: C12.1 63.62,52.7 R12.2
N$3
  Top 0.5: IC15.5 28.04,7.12 L3.1
N$00004
  Top 0.3: IC4.8 62.31,48.62 62.5,48.8 62.5,49.7 62.7,49.9 C17.2
  Top 0.6: C17.2 63.65,49.9 R16.2
N$5
  Top 0.6: LED1.A 1.6,46.35 R21.1
N$00006
  Top 0.6: R34.1 67,31.95 | 67,31.95 Q1.1 | 67,31.95 66.9,31.95 65.75,31.95 R32.1
N$7
  Top 0.2: IC8.P72 46.75,21.7 46.95,21.5 R48.2
N$00008
  Top 0.3: IC8.P93 51.75,36.25 56.1,31.9 62.2,31.9 64.05,30.05 66.9,30.05 R34.2
N$00009  (via drill 0.3)
  Top 0.3: R27.1 66.2,36.7 66.4,36.9 66.4,37.8 v66.6,38 67.05,38 67.25,37.8 IC7.4
  Top 0.6: R28.1 C31.1 v70.4,34.2
  Bottom 0.3: v70.4,34.2 69.8,34.2 66.6,37.4 v66.6,38
N$00010
  Top 0.3: R30.1 66.2,35.3 66.4,35.1 66.4,34.2 66.6,34 67.05,34 67.25,34.2 IC7.5
N$00011  (via drill 0.3)
  Top 0.3: R27.2 63.65,37 | IC4.4 62.7,46.02 v62.7,46
  Top 0.6: R27.2 63.65,38.1 C29.1 | 63.65,37 v62.7,37
  Bottom 0.3: v62.7,37 v62.7,46
N$00012  (via drill 0.3)
  Top 0.3: R30.2 63.65,35 | IC4.3 62,45.36 v62,45.3
  Top 0.6: C33.2 63.62,35.3 R30.2 | 63.65,35 v62,35
  Bottom 0.3: v62,35 v62,45.3
N$00013  (via drill 0.3)
  Top 0.3: R12.1 66.2,52.7 66.4,52.9 66.4,53.8 v66.6,54 67.05,54 67.25,53.8 IC3.4
  Top 0.6: R13.1 C16.1 v70.5,50.2
  Bottom 0.3: v70.5,50.2 69.8,50.2 66.6,53.4 v66.6,54
N$00014
  Top 0.3: C32.1 58.85,36.05 IC6.4
N$00015
  Top 0.6: SJ1.2 X3.7
N$00016
  pour Top (no thermals): 43.1,4.4 42.2,4.4 40.9,3.1 39.6,3.1 39.6,4.9 41.4,4.9 42.6,6.1 44.1,6.1 44.1,5.4
N$00017
  Top 0.2: X4.14 11.73,24.93 12.9,26.1 14.7,26.1 15,26.4 15,31 16.6,32.6 R31.2
N$00018
  Top 0.6: D11.A D10.C 43.9,4 43.05,3.15 C50.2
N$00019
  pour Top (no thermals): 44.1,7.9 45.2,9 45.2,10.7 44.9,11 39.6,11 39.6,9 41.5,9 42.6,7.9
N$00020
  Top 0.6: R18.2 12.15,49.38 11.55,49.98 X2.S2
N$00021
  Top 0.6: X2.S1 11.45,62.02 12.05,62.62 C4.2
N$00022
  Top 0.2: IC2.7 34.3,57.75 34.25,57.7 29.35,57.7 R10.2
N$00023
  Top 0.2: IC2.8 34.3,57.25 34.25,57.3 30.4,57.3 30.2,57.1 30.2,56 30,55.8 R11.2
N$00024
  Top 0.2: IC2.63 37.25,63.4 37.05,63.6 36.5,63.6 36.1,64 36.1,65.8 35.9,66 IC1.5 31.85,66 R5.1
N$00025
  Top 0.2: IC2.62 37.75,63.6 37.35,64 36.8,64 36.5,64.3 36.5,66.75 36.3,66.95 IC1.4 31.85,66.95 R1.1
N$00026
  Top 0.2: IC1.3 37.1,66.95 36.9,66.75 36.9,64.6 37.1,64.4 37.65,64.4 38.25,63.8 IC2.61
  Top 0.5: IC1.3 39,66.95 R3.1
N$00027
  Top 0.2: IC2.2 33.5,60.25 33.3,60.45 33.3,62.6 32.98,62.92 X1.3
  Top 0.6: C3.1 32.1,64.05 32.1,63.08 X1.3
N$00028
  Top 0.2: IC2.3 31.95,59.75 30.62,61.08 X1.1
  Top 0.6: X1.1 28.38,61.08 C6.1
N$00029
  Top 0.3: IC16.1 49.85,6 C49.1
  Top 0.6: C49.1 R66.1 53,5.85 R65.2
N$00030
  Top 0.6: R57.1 LED.A
N$00031
  Top 0.2: IC8.P6 16.48,41.25 JP1.7
N$00032
  Top 0.3: IC16.5 49.85,8 C45.2
  Top 0.6: C45.2 R63.2 53,8.15 R64.1
N$00033
  Top 0.3: R69.1 15,18.07
  Top 0.6: X4.1 15,18.07 15,20.36 | 15,20.36 X4.2 | X4.3 15,22.64 15,20.36
N$00034
  Top 0.2: X4.13 11.64,22.64 12.8,23.8 15.2,23.8 15.5,24.1 15.5,30.3 15.7,30.5 R33.2
N$00035
  Top 0.2: IC8.P7 16.48,40.75 JP1.8
N$00036
  Top 0.3: R37.2 17.2,27 18.7,28.5 R35.2
  Top 0.6: R36.2 R35.2
N$00037
  Top 0.3: R40.2 17.2,25.5 18.7,27 R37.1
  Top 0.6: R37.1 R38.2
N$00038
  Top 0.3: R42.2 17.2,24 18.7,25.5 R40.1
  Top 0.6: R41.2 R40.1
N$00039
  Top 0.3: R16.1 66.2,51.3 66.4,51.1 66.4,50.2 66.6,50 67.05,50 67.25,50.2 IC3.5
N$00040
  Top 0.3: R46.2 17.2,22.5 18.7,24 R42.1
  Top 0.6: R42.1 R43.2
N$00041
  Top 0.3: R49.2 17.2,21 18.7,22.5 R46.1
  Top 0.6: R47.2 R46.1
N$00042
  Top 0.3: R51.2 17.2,19.5 18.7,21 R49.1
  Top 0.6: R49.1 R50.2
N$00043
  Top 0.5: IC1.1 39,65.05 R3.2 R4.1
N$00044
  Top 0.3: R55.2 17.2,18 18.7,19.5 R51.1
  Top 0.6: R52.2 R51.1
N$00045
  Top 0.3: IC19.4 20.95,14.2 20.75,14 19.25,14 19.05,13.8 IC19.1 19.05,12.4 18.85,12.2 16.3,12.2 15,13.5 R69.2
N$00046
  Top 0.3: IC2.14 33.9,54.25 33.5,53.85 33.5,52.6 34.05,52.05 RST.2 34.05,51.4 33.5,51.95 R17.1
N$00047
  Top 0.3: C24.2 63.4,42.4 64.03,43.03 IC5.5
N$00048  (via drill 0.3)
  Top 0.2: IC8.P5 25.25,41.75 v25,42
  Bottom 0.2: v25,42 24.2,41.2 19.07,41.2 JP1.5
N$00049
  Top 0.3: IC2.6 31.25,58.25 30.6,58.9 R9.1
N$50
  Top 0.5: IC14.5 22.04,7.12 L2.1
N$00051  (via drill 0.3)
  Top 0.2: IC8.P8 25.25,40.25 v25,40
  Bottom 0.2: v25,40 24.2,40.8 19.07,40.8 JP1.6
N$00052
  Top 0.2: IC8.P1 22.02,43.75 JP1.3
N$00053
  Top 0.3: R25.2 66.1,42.4 65.33,43.17 IC5.7
N$00054
  Top 0.6: C26.1 R25.1
N$00055
  Top 0.2: C31.2 70.4,37.8 70.2,38 68.95,38 68.75,37.8 IC7.1
  Top 0.6: C31.2 R28.2 R29.1
N$00056
  Top 0.2: IC8.P2 24.06,43.25 JP1.1
N$00057
  Top 0.3: C16.2 70.5,53.8 70.3,54 68.95,54 68.75,53.8 IC3.1
  Top 0.6: R14.1 R13.2 C16.2
N$00058
  Top 0.2: IC8.P9 26.85,39.7 25.68,39.7 24.98,39 23.81,39 JP1.2
N$00059
  Top 0.2: IC8.P10 25.95,39.25 24.9,38.2 22.07,38.2 JP1.4
N$00060
  Top 0.3: IC17.1 70.75,26.05 70.1,26.7 70.1,27.5 69.65,27.95 IC17.4
  Top 0.6: IC17.1 73.6,26.05 R39.2
N$00061  (via drill 0.3)
  Top 0.3: IC9.3 53.91,29.29 v53.9,29.3
  Top 0.6: IC17.3 72.95,27.95 v73,28
  Bottom 0.3: v53.9,29.3 58.3,29.3 61,32 68,32 72,28 v73,28
N$00062
  Top 0.3: IC18.1 70.75,22.55 70.1,23.2 70.1,24 69.65,24.45 IC18.4
  Top 0.6: IC18.1 73.6,22.55 R45.2
N$00063  (via drill 0.3)
  Top 0.3: IC9.23 61.68,29.92 v62.2,29.4
  Top 0.6: IC18.3 72.95,24.45 v73,24.5
  Bottom 0.3: v62.2,29.4 67.1,24.5 v73,24.5
N$00064
  Top 0.3: R68.1 75.95,32.5 77.5,32.5 78.63,33.63 X3.20
N$00065
  Top 0.3: IC19.3 20.95,12.2 22.8,12.2 23,12.4 23,14.8 23.2,15 R61.2
OSC_CLK
  Top 0.2: X5.3 35.75,19.57 IC8.P50
PROGRAM
  Top 0.2: IC8.P37 29.25,22.75 29,22.5 R53.2
SUPPLY_SEC
  pour Top (no thermals): 6,47 8.88,47 8.88,38.68 6,38.68
TCK
  Top 0.2: IC2.38 47.35,55.75 47.6,55.5 47.6,51 46.75,50.15 IC8.P109
TDI
  Top 0.2: IC8.P110 46.25,45.1 46.45,44.9 47,44.9 47.2,45.1 47.2,50 48,50.8 48,55.9 47.65,56.25 IC2.39
TDO
  Top 0.2: IC8.P106 48.1,42.75 47.6,43.25 47.6,49.8 48.4,50.6 48.4,56.2 47.85,56.75 IC2.40
TMS
  Top 0.2: IC8.P107 48.2,43.25 48,43.45 48,49.6 48.8,50.4 48.8,56.6 48.15,57.25 IC2.41
USB_DM
  Top 0.2: R10.1 25.85,57.4 D1.3 25.85,57.45 25.13,56.73 14.23,56.73 X2.2
USB_DP
  Top 0.152: 11.75,57.25 X2.3
  Top 0.2: R11.1 25.85,55.8 D1.2 25.85,55.65 25.1,56.4 14.7,56.4 14.3,56 13,56 11.75,57.25
USER_LED
  Top 0.2: R57.2 34,19.6 34.75,20.35 IC8.P48
V_BUS  (via drill 0.3)
  Top 0.6: R6.1 44.35,64.35 v44.5,64.2 | C7.1 v22,58.5 v22,57.6 23.85,57.6 D1.4
  Top 1: X2.1 16.3,54.75 | 16.3,54.75 v19.9,54.75 v21,54.75 v22.05,54.75 | 16.3,54.75 16.3,45.5 F1.2
  Bottom 0.6: v44.5,64.2 44.5,68.3 44.3,68.5 22.2,68.5 22,68.3 v22,58.5 v22,57.6 22,54.75 v22.05,54.75 v21,54.75 v19.9,54.75 X2.1
VGA_3V3
  Top 0.3: R56.2 20.15,17 20.35,16.8 24.26,16.8 R61.3
  Top 0.6: R55.1 R56.2
VGA_G0
  Top 0.2: IC8.P26 22.85,31.25 22.65,31.05 22.65,28.7 22.45,28.5 R36.1
VGA_G1
  Top 0.2: IC8.P27 23.3,30.75 23.1,30.55 23.1,27.5 22.6,27 R38.1
VGA_G2
  Top 0.2: IC8.P29 23.7,29.75 23.5,29.55 23.5,26.4 22.6,25.5 R41.1
VGA_G3
  Top 0.2: IC8.P30 24.1,29.25 23.9,29.05 23.9,25.3 22.6,24 R43.1
VGA_G4
  Top 0.2: IC8.P32 24.5,28.25 24.3,28.05 24.3,24.2 22.6,22.5 R47.1
VGA_G5
  Top 0.2: IC8.P33 24.9,27.75 24.7,27.55 24.7,23.1 22.6,21 R50.1
VGA_G6
  Top 0.2: IC8.P34 25.3,27.25 25.1,27.05 25.1,22 22.6,19.5 R52.1
VGA_G7
  Top 0.2: IC8.P35 25.7,26.75 25.5,26.55 25.5,20.9 22.6,18 R56.1
VGA_HSYNC
  Top 0.2: R33.1 21.3,30.5 21.5,30.7 21.5,32.05 22.7,33.25 IC8.P22
VGA_VSYNC
  Top 0.2: R31.1 20.6,32.6 21.75,33.75 IC8.P21
VIDEO_0
  Top 0.3: D4.C 75.5,35.15 75.74,35.15
  Top 0.6: SJ1.1 75.74,35.15 R29.2
VIDEO_1
  Top 0.3: X3.2 75.5,48.79 | 75.5,48.79 73.4,48.79 73.2,48.99 R14.2 | D2.C 75.5,48.79
VPHY
  Top 0.3: IC2.4 31.35,59.25 30.6,60 26.55,60 C8.1
  Top 0.6: FB1.2 26.65,63.65 C5.1 26.65,60.6 C8.1
VPLL
  Top 0.3: 29.75,54.1 30.45,54.1 30.65,54.3 30.65,56.55 30.85,56.75 IC2.9
  Top 0.6: FB2.2 29.7,52.65 C15.1 29.75,54.1 C11.1
X_CMD
  Top 0.3: 76.9,26 D5.C 78.1,26.1 78.72,26.72 X3.10
  Top 0.6: R39.1 76.9,26
Y_CMD
  Top 0.3: 77,22.5 D6.C 78.2,22.4 78.4,22.2 78.4,18.64 78.6,18.44 X3.13
  Top 0.6: 77,22.5 R45.1

## Text on the board
Top: REMscan | 270223kw
tNames: DONE
tStop: BTN1 | BTN2 | v1 | HSWAP | DEBUG | M1 | M0